# EAGLE design TRHPSVG_Controls_v2 (EAGLE 9.6.2)
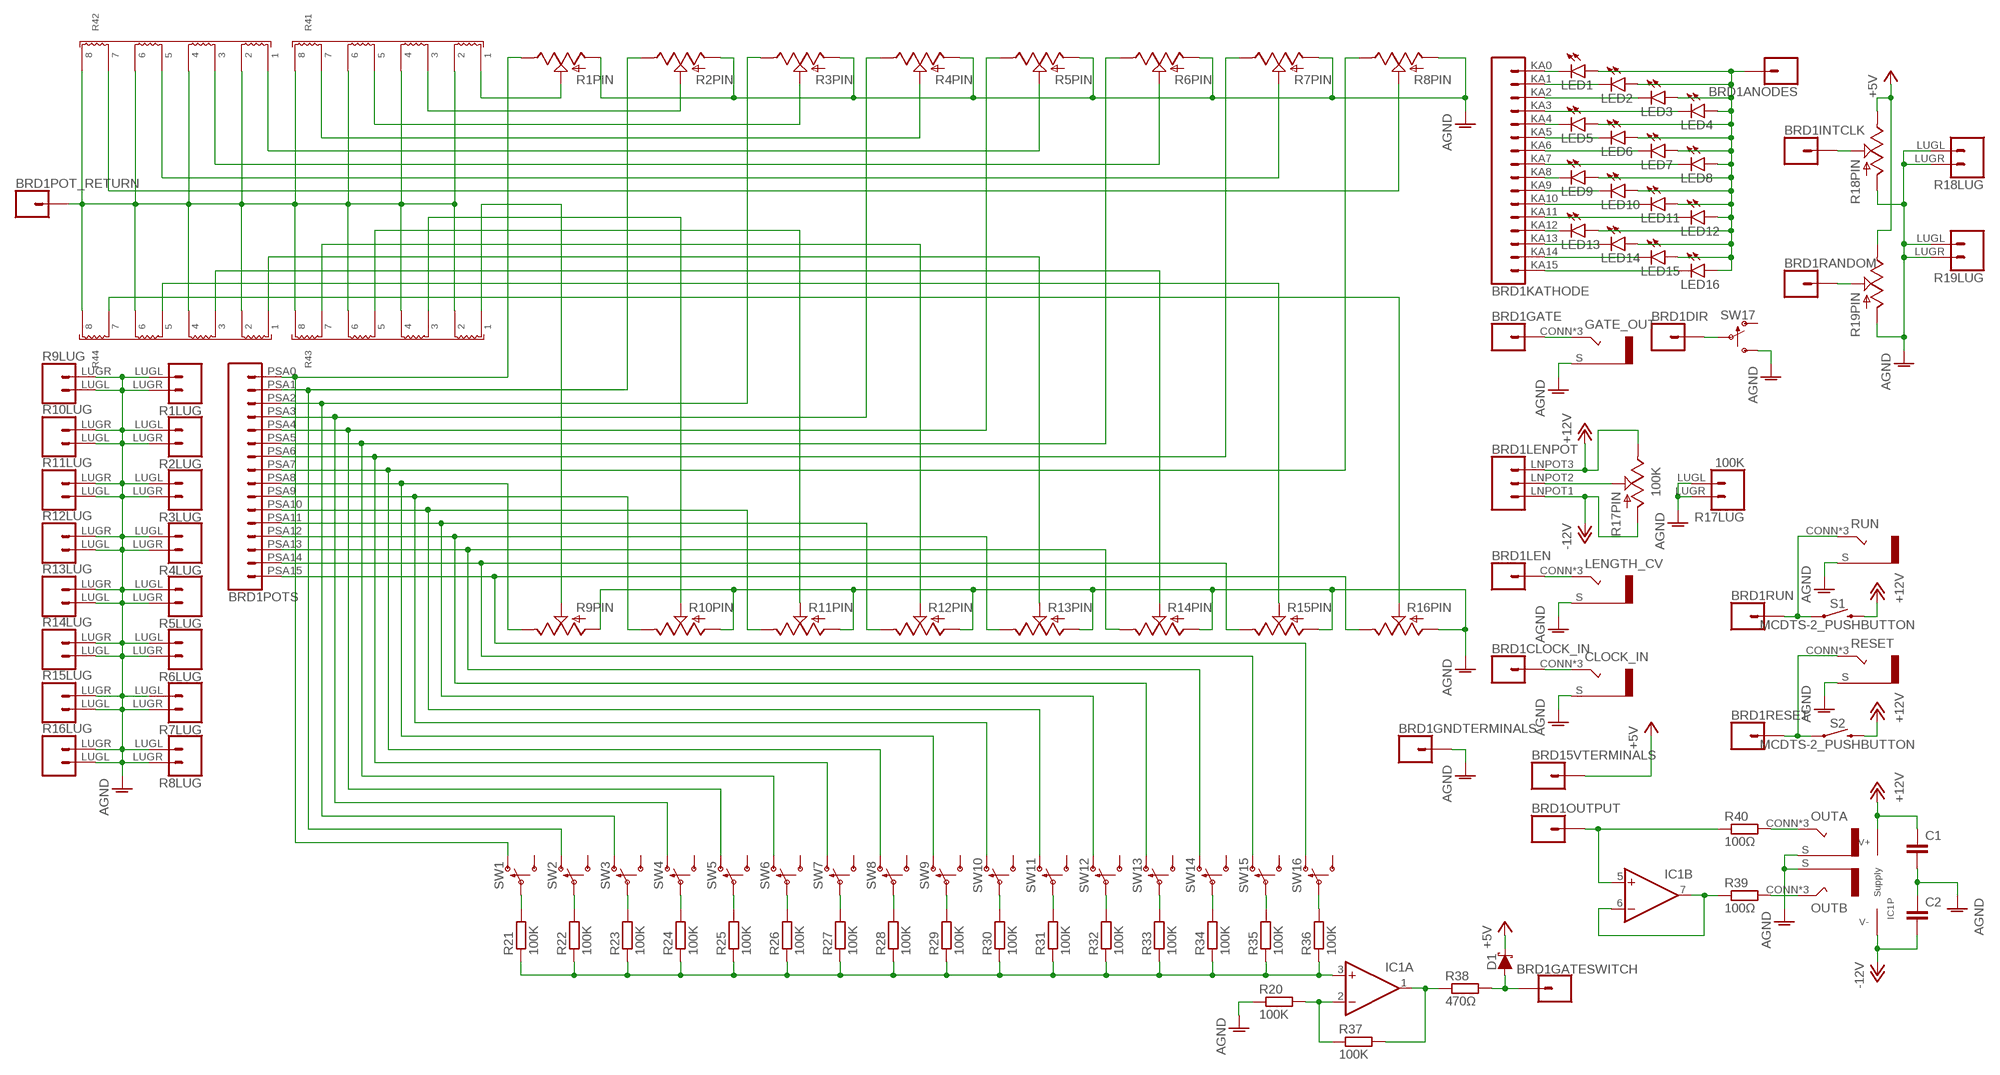
[diagram p0: schematic, sheet 1]

## Parts
BRD1  TRHPSVG_LINK  [TRHPSVG]
C1  C-EU050-025X075  [C050-025X075]
C2  C-EU050-025X075  [C050-025X075]
CLOCK_IN  COMBI-JACK  [COMBOJACK_PANEL]
D1  SCHOTTKY_DO35  [DO35-7]
GATE_OUT  COMBI-JACK  [COMBOJACK_PANEL]
IC1  TL0X2DIL  [DIL08]
LED1  LED3MM  [LED3MM]
LED2  LED3MM  [LED3MM]
LED3  LED3MM  [LED3MM]
LED4  LED3MM  [LED3MM]
LED5  LED3MM  [LED3MM]
LED6  LED3MM  [LED3MM]
LED7  LED3MM  [LED3MM]
LED8  LED3MM  [LED3MM]
LED9  LED3MM  [LED3MM]
LED10  LED3MM  [LED3MM]
LED11  LED3MM  [LED3MM]
LED12  LED3MM  [LED3MM]
LED13  LED3MM  [LED3MM]
LED14  LED3MM  [LED3MM]
LED15  LED3MM  [LED3MM]
LED16  LED3MM  [LED3MM]
LENGTH_CV  COMBI-JACK  [COMBOJACK_PANEL]
OUTA  COMBI-JACK  [COMBOJACK_PANEL]
OUTB  COMBI-JACK  [COMBOJACK_PANEL]
R1  POTENTIOMETER  [ALPHA_RV09_9MMPOT]
R2  POTENTIOMETER  [ALPHA_RV09_9MMPOT]
R3  POTENTIOMETER  [ALPHA_RV09_9MMPOT]
R4  POTENTIOMETER  [ALPHA_RV09_9MMPOT]
R5  POTENTIOMETER  [ALPHA_RV09_9MMPOT]
R6  POTENTIOMETER  [ALPHA_RV09_9MMPOT]
R7  POTENTIOMETER  [ALPHA_RV09_9MMPOT]
R8  POTENTIOMETER  [ALPHA_RV09_9MMPOT]
R9  POTENTIOMETER  [ALPHA_RV09_9MMPOT]
R10  POTENTIOMETER  [ALPHA_RV09_9MMPOT]
R11  POTENTIOMETER  [ALPHA_RV09_9MMPOT]
R12  POTENTIOMETER  [ALPHA_RV09_9MMPOT]
R13  POTENTIOMETER  [ALPHA_RV09_9MMPOT]
R14  POTENTIOMETER  [ALPHA_RV09_9MMPOT]
R15  POTENTIOMETER  [ALPHA_RV09_9MMPOT]
R16  POTENTIOMETER  [ALPHA_RV09_9MMPOT]
R17  100K  POTENTIOMETER  [ALPHA_RV09_9MMPOT]
R18  POTENTIOMETER  [ALPHA_RV09_9MMPOT]
R19  POTENTIOMETER  [ALPHA_RV09_9MMPOT]
R20  100K  R-EU_0207/10  [0207/10]
R21  100K  R-EU_0207/10  [0207/10]
R22  100K  R-EU_0207/10  [0207/10]
R23  100K  R-EU_0207/10  [0207/10]
R24  100K  R-EU_0207/10  [0207/10]
R25  100K  R-EU_0207/10  [0207/10]
R26  100K  R-EU_0207/10  [0207/10]
R27  100K  R-EU_0207/10  [0207/10]
R28  100K  R-EU_0207/10  [0207/10]
R29  100K  R-EU_0207/10  [0207/10]
R30  100K  R-EU_0207/10  [0207/10]
R31  100K  R-EU_0207/10  [0207/10]
R32  100K  R-EU_0207/10  [0207/10]
R33  100K  R-EU_0207/10  [0207/10]
R34  100K  R-EU_0207/10  [0207/10]
R35  100K  R-EU_0207/10  [0207/10]
R36  100K  R-EU_0207/10  [0207/10]
R37  100K  R-EU_0207/10  [0207/10]
R38  470Ω  R-EU_0207/10  [0207/10]
R39  100Ω  R-EU_0207/10  [0207/10]
R40  100Ω  R-EU_0207/10  [0207/10]
R41  4XISO_RESISTOR_NETWORK_2.54  [4_ISO_RES_NET_2.54]
R42  4XISO_RESISTOR_NETWORK_2.54  [4_ISO_RES_NET_2.54]
R43  4XISO_RESISTOR_NETWORK_2.54  [4_ISO_RES_NET_2.54]
R44  4XISO_RESISTOR_NETWORK_2.54  [4_ISO_RES_NET_2.54]
RESET  COMBI-JACK  [COMBOJACK_PANEL]
RUN  COMBI-JACK  [COMBOJACK_PANEL]
S1  MCDTS-2_PUSHBUTTON  [MCDTS-2_PUSHBUTTON]
S2  MCDTS-2_PUSHBUTTON  [MCDTS-2_PUSHBUTTON]
SW1  SPDT_SWITCHDW1  [MICRODPDT-DW1]
SW2  SPDT_SWITCHDW1  [MICRODPDT-DW1]
SW3  SPDT_SWITCHDW1  [MICRODPDT-DW1]
SW4  SPDT_SWITCHDW1  [MICRODPDT-DW1]
SW5  SPDT_SWITCHDW1  [MICRODPDT-DW1]
SW6  SPDT_SWITCHDW1  [MICRODPDT-DW1]
SW7  SPDT_SWITCHDW1  [MICRODPDT-DW1]
SW8  SPDT_SWITCHDW1  [MICRODPDT-DW1]
SW9  SPDT_SWITCHDW1  [MICRODPDT-DW1]
SW10  SPDT_SWITCHDW1  [MICRODPDT-DW1]
SW11  SPDT_SWITCHDW1  [MICRODPDT-DW1]
SW12  SPDT_SWITCHDW1  [MICRODPDT-DW1]
SW13  SPDT_SWITCHDW1  [MICRODPDT-DW1]
SW14  SPDT_SWITCHDW1  [MICRODPDT-DW1]
SW15  SPDT_SWITCHDW1  [MICRODPDT-DW1]
SW16  SPDT_SWITCHDW1  [MICRODPDT-DW1]
SW17  SPDT_SWITCHDW1  [MICRODPDT-DW1]

## Nets
+5V: BRD1.5V1 BRD1.5V2 BRD1.5V3 D1.C R18.C3(PIN:B) R19.C3(PIN:B)
+12V: BRD1.LNPOT3 C1.1 IC1.8(P:V+) R17.C3(PIN:B) S1.P$3 S1.P$4 S2.P$3 S2.P$4
-12V: BRD1.LNPOT1 C2.2 IC1.4(P:V-) R17.C1(PIN:A)
AGND: BRD1.GND1 BRD1.GND2 BRD1.GND3 C1.2 C2.1 CLOCK_IN.S GATE_OUT.S LENGTH_CV.S OUTA.S OUTB.S R1.C1(PIN:A) R1.LUGL R1.LUGR R2.C1(PIN:A) R2.LUGL R2.LUGR R3.C1(PIN:A) R3.LUGL R3.LUGR R4.C1(PIN:A) R4.LUGL R4.LUGR R5.C1(PIN:A) R5.LUGL R5.LUGR R6.C1(PIN:A) R6.LUGL R6.LUGR R7.C1(PIN:A) R7.LUGL R7.LUGR R8.C1(PIN:A) R8.LUGL R8.LUGR R9.C1(PIN:A) R9.LUGL R9.LUGR R10.C1(PIN:A) R10.LUGL R10.LUGR R11.C1(PIN:A) R11.LUGL R11.LUGR R12.C1(PIN:A) R12.LUGL R12.LUGR R13.C1(PIN:A) R13.LUGL R13.LUGR R14.C1(PIN:A) R14.LUGL R14.LUGR R15.C1(PIN:A) R15.LUGL R15.LUGR R16.C1(PIN:A) R16.LUGL R16.LUGR R17.LUGL R17.LUGR R18.C1(PIN:A) R18.LUGL R18.LUGR R19.C1(PIN:A) R19.LUGL R19.LUGR R20.1 RESET.S RUN.S SW17.C3(S)
N$1: R1.C2(PIN:W) R41.P$1
N$2: R4.C2(PIN:W) R41.P$7
N$3: R2.C2(PIN:W) R41.P$3
N$4: BRD1.PSA0 R1.C3(PIN:B) SW1.C1(O)
N$5: BRD1.PSA1 R2.C3(PIN:B) SW2.C1(O)
N$6: R3.C2(PIN:W) R41.P$5
N$7: R5.C2(PIN:W) R42.P$1
N$8: R6.C2(PIN:W) R42.P$3
N$9: R7.C2(PIN:W) R42.P$5
N$10: R8.C2(PIN:W) R42.P$7
N$11: BRD1.PSA2 R3.C3(PIN:B) SW3.C1(O)
N$12: BRD1.PSA3 R4.C3(PIN:B) SW4.C1(O)
N$13: BRD1.PSA4 R5.C3(PIN:B) SW5.C1(O)
N$14: R36.2 SW16.C2(P)
N$15: BRD1.PSA6 R7.C3(PIN:B) SW7.C1(O)
N$16: BRD1.PSA7 R8.C3(PIN:B) SW8.C1(O)
N$17: R9.C2(PIN:W) R43.P$1
N$18: R21.2 SW1.C2(P)
N$19: R22.2 SW2.C2(P)
N$20: R10.C2(PIN:W) R43.P$3
N$21: R23.2 SW3.C2(P)
N$22: R11.C2(PIN:W) R43.P$5
N$23: R12.C2(PIN:W) R43.P$7
N$24: R24.2 SW4.C2(P)
N$25: R25.2 SW5.C2(P)
N$26: R13.C2(PIN:W) R44.P$1
N$27: R14.C2(PIN:W) R44.P$3
N$28: BRD1.PSA13 R14.C3(PIN:B) SW14.C1(O)
N$29: BRD1.PSA14 R15.C3(PIN:B) SW15.C1(O)
N$30: BRD1.PSA15 R16.C3(PIN:B) SW16.C1(O)
N$31: R15.C2(PIN:W) R44.P$5
N$32: R16.C2(PIN:W) R44.P$7
N$33: BRD1.KA0 LED1.K(C)
N$34: BRD1.AN1 BRD1.AN2 LED1.A LED2.A LED3.A LED4.A LED5.A LED6.A LED7.A LED8.A LED9.A LED10.A LED11.A LED12.A LED13.A LED14.A LED15.A LED16.A
N$35: BRD1.KA1 LED2.K(C)
N$36: BRD1.KA2 LED3.K(C)
N$37: BRD1.KA3 LED4.K(C)
N$38: BRD1.KA4 LED5.K(C)
N$39: BRD1.KA5 LED6.K(C)
N$40: BRD1.KA6 LED7.K(C)
N$41: BRD1.KA7 LED8.K(C)
N$42: BRD1.KA8 LED9.K(C)
N$43: BRD1.KA9 LED10.K(C)
N$44: BRD1.KA10 LED11.K(C)
N$45: BRD1.KA11 LED12.K(C)
N$46: BRD1.KA12 LED13.K(C)
N$47: BRD1.KA13 LED14.K(C)
N$48: BRD1.KA14 LED15.K(C)
N$49: BRD1.KA15 LED16.K(C)
N$50: BRD1.LENGTH LENGTH_CV.CONN(T) LENGTH_CV.T1(T) LENGTH_CV.T2(T)
N$51: BRD1.CLKIN CLOCK_IN.CONN(T) CLOCK_IN.T1(T) CLOCK_IN.T2(T)
N$52: BRD1.SEQ IC1.5(B:+IN) R40.1
N$53: BRD1.GATE GATE_OUT.CONN(T) GATE_OUT.T1(T) GATE_OUT.T2(T)
N$54: BRD1.DIR SW17.C2(P)
N$55: BRD1.LNPOT2 R17.C2(PIN:W)
N$56: BRD1.PSA5 R6.C3(PIN:B) SW6.C1(O)
N$57: BRD1.INTC R18.C2(PIN:W)
N$58: BRD1.RND R19.C2(PIN:W)
N$59: BRD1.RUN RUN.CONN(T) RUN.T1(T) RUN.T2(T) S1.P$1 S1.P$2
N$60: BRD1.SRST RESET.CONN(T) RESET.T1(T) RESET.T2(T) S2.P$1 S2.P$2
N$61: R26.2 SW6.C2(P)
N$62: R27.2 SW7.C2(P)
N$63: R28.2 SW8.C2(P)
N$64: R29.2 SW9.C2(P)
N$65: R30.2 SW10.C2(P)
N$66: R31.2 SW11.C2(P)
N$67: R32.2 SW12.C2(P)
N$68: R33.2 SW13.C2(P)
N$69: BRD1.PSA8 R9.C3(PIN:B) SW9.C1(O)
N$70: BRD1.PSA10 R11.C3(PIN:B) SW11.C1(O)
N$71: BRD1.PSA9 R10.C3(PIN:B) SW10.C1(O)
N$72: BRD1.PSA12 R13.C3(PIN:B) SW13.C1(O)
N$73: BRD1.PSA11 R12.C3(PIN:B) SW12.C1(O)
N$74: R34.2 SW14.C2(P)
N$75: R35.2 SW15.C2(P)
N$76: IC1.3(A:+IN) R21.1 R22.1 R23.1 R24.1 R25.1 R26.1 R27.1 R28.1 R29.1 R30.1 R31.1 R32.1 R33.1 R34.1 R35.1 R36.1
N$77: IC1.2(A:-IN) R20.2 R37.1
N$78: IC1.1(A:OUT) R37.2 R38.1
N$79: BRD1.GSW D1.A R38.2
N$80: IC1.6(B:-IN) IC1.7(B:OUT) R39.1
N$81: OUTB.CONN(T) OUTB.T1(T) OUTB.T2(T) R39.2
N$82: OUTA.CONN(T) OUTA.T1(T) OUTA.T2(T) R40.2
N$83: BRD1.POT-R R41.P$2 R41.P$4 R41.P$6 R41.P$8 R42.P$2 R42.P$4 R42.P$6 R42.P$8 R43.P$2 R43.P$4 R43.P$6 R43.P$8 R44.P$2 R44.P$4 R44.P$6 R44.P$8
Unconnected: SW1.C3(S) SW2.C3(S) SW3.C3(S) SW4.C3(S) SW5.C3(S) SW6.C3(S) SW7.C3(S) SW8.C3(S) SW9.C3(S) SW10.C3(S) SW11.C3(S) SW12.C3(S) SW13.C3(S) SW14.C3(S) SW15.C3(S) SW16.C3(S) SW17.C1(O)

## Library data of the parts
BRD1 = ElectricNoodleBox:TRHPSVG_LINK
C1 C2 = rcl:C-EU: CAPACITOR, European symbol; SPICEPREFIX: C
CLOCK_IN GATE_OUT LENGTH_CV OUTA OUTB RESET RUN = ElectricNoodleBox:COMBI-JACK
D1 = ElectricNoodleBox:SCHOTTKY_DO35
IC1 = ElectricNoodleBox:TL0X2
LED1-LED16 = led:LED: LED OSRAM: - CHIPLED LG R971, LG N971, LY N971, LG Q971, LY Q971, LO R971, LY R971 LH N974, LH R974 LS Q976, LO Q976, LY Q976 LO Q996 - Hyper CHIPLED LW Q18S LB Q993, LB Q99A, LB R99A - SideLED LS A670, LO A670, LY A670, LG A670, LP A670 LB A673, LV A673, LT A673, LW A673 LH A674 LY A675 LS A676, LA A676, LO A676, LY A676, LW A676 LS A679, LY A679, LG A679 - Hyper Micro SIDELED® LS Y876, LA Y876, LO Y876, LY Y876 LT Y87S - SmartLED LW L88C, LW L88S LB L89C, LB L89S, LG L890 LS L89K, LO L89K, LY L89K LS L896, LA L896, LO L896, LY L896 - TOPLED LS T670, LO T670, LY T670, LG T670, LP T670 LSG T670, LSP T670, LSY T670, LOP T670, LYG T670 LG T671, LOG T671, LSG T671 LB T673, LV T673, LT T673, LW T673 LH T674 LS T676, LA T676, LO T676, LY T676, LB T676, LH T676, LSB T676, LW T676 LB T67C, LV T67C, LT T67C, LS T67K, LO T67K, LY T67K, LW E67C LS E67B, LA E67B, LO E67B, LY E67B, LB E67C, LV E67C, LT E67C LW T67C LS T679, LY T679, LG T679 LS T770, LO T770, LY T770, LG T770, LP T770 LB T773, LV T773, LT T773, LW T773 LH T774 LS E675, LA E675, LY E675, LS T675 LS T776, LA T776, LO T776, LY T776, LB T776 LHGB T686 LT T68C, LB T68C - Hyper Mini TOPLED® LB M676 - Mini TOPLED Santana® LG M470 LS M47K, LO M47K, LY M47K Source: http://www.osram.convergy.de LUXEON: - LUMILED® LXK2-PW12-R00, LXK2-PW12-S00, LXK2-PW14-U00, LXK2-PW14-V00 LXK2-PM12-R00, LXK2-PM12-S00, LXK2-PM14-U00 LXK2-PE12-Q00, LXK2-PE12-R00, LXK2-PE12-S00, LXK2-PE14-T00, LXK2-PE14-U00 LXK2-PB12-K00, LXK2-PB12-L00, LXK2-PB12-M00, LXK2-PB14-N00, LXK2-PB14-P00, LXK2-PB14-Q00 LXK2-PR12-L00, LXK2-PR12-M00, LXK2-PR14-Q00, LXK2-PR14-R00 LXK2-PD12-Q00, LXK2-PD12-R00, LXK2-PD12-S00 LXK2-PH12-R00, LXK2-PH12-S00 LXK2-PL12-P00, LXK2-PL12-Q00, LXK2-PL12-R00 Source: www.luxeon.com KINGBRIGHT: KA-3528ASYC Source: www.kingbright.com
R1-R19 = ElectricNoodleBox:POTENTIOMETER
R20-R40 = rcl:R-EU_: RESISTOR, European symbol; SPICEPREFIX: R
R41-R44 = ElectricNoodleBox:4XISO_RESISTOR_NETWORK_2.54
S1 S2 = ElectricNoodleBox:MCDTS-2_PUSHBUTTON
SW1-SW17 = ElectricNoodleBox:SPDT_SWITCH

## Board
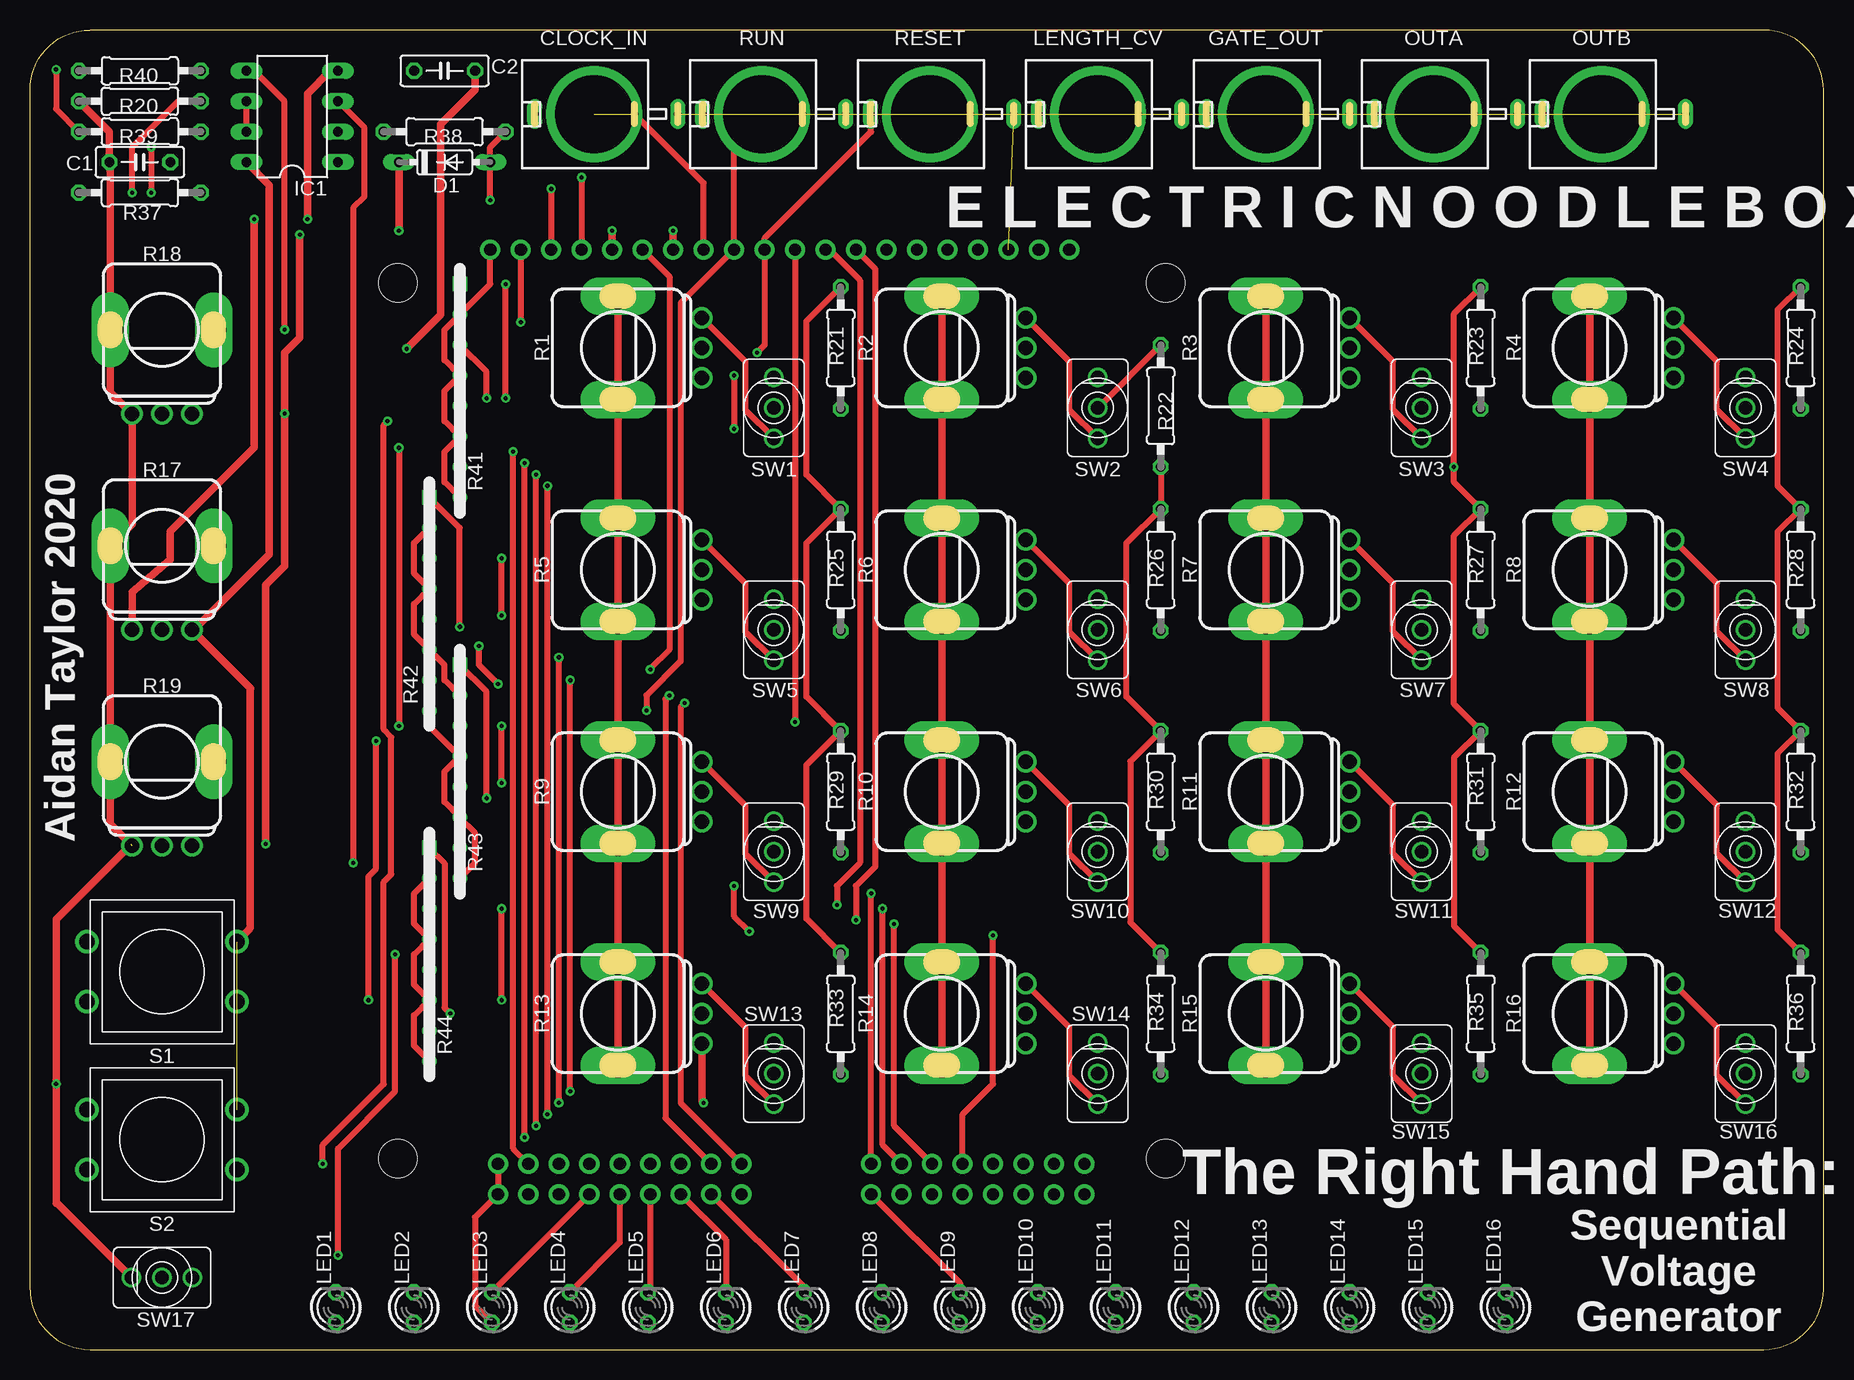
[diagram p1: board, top side]
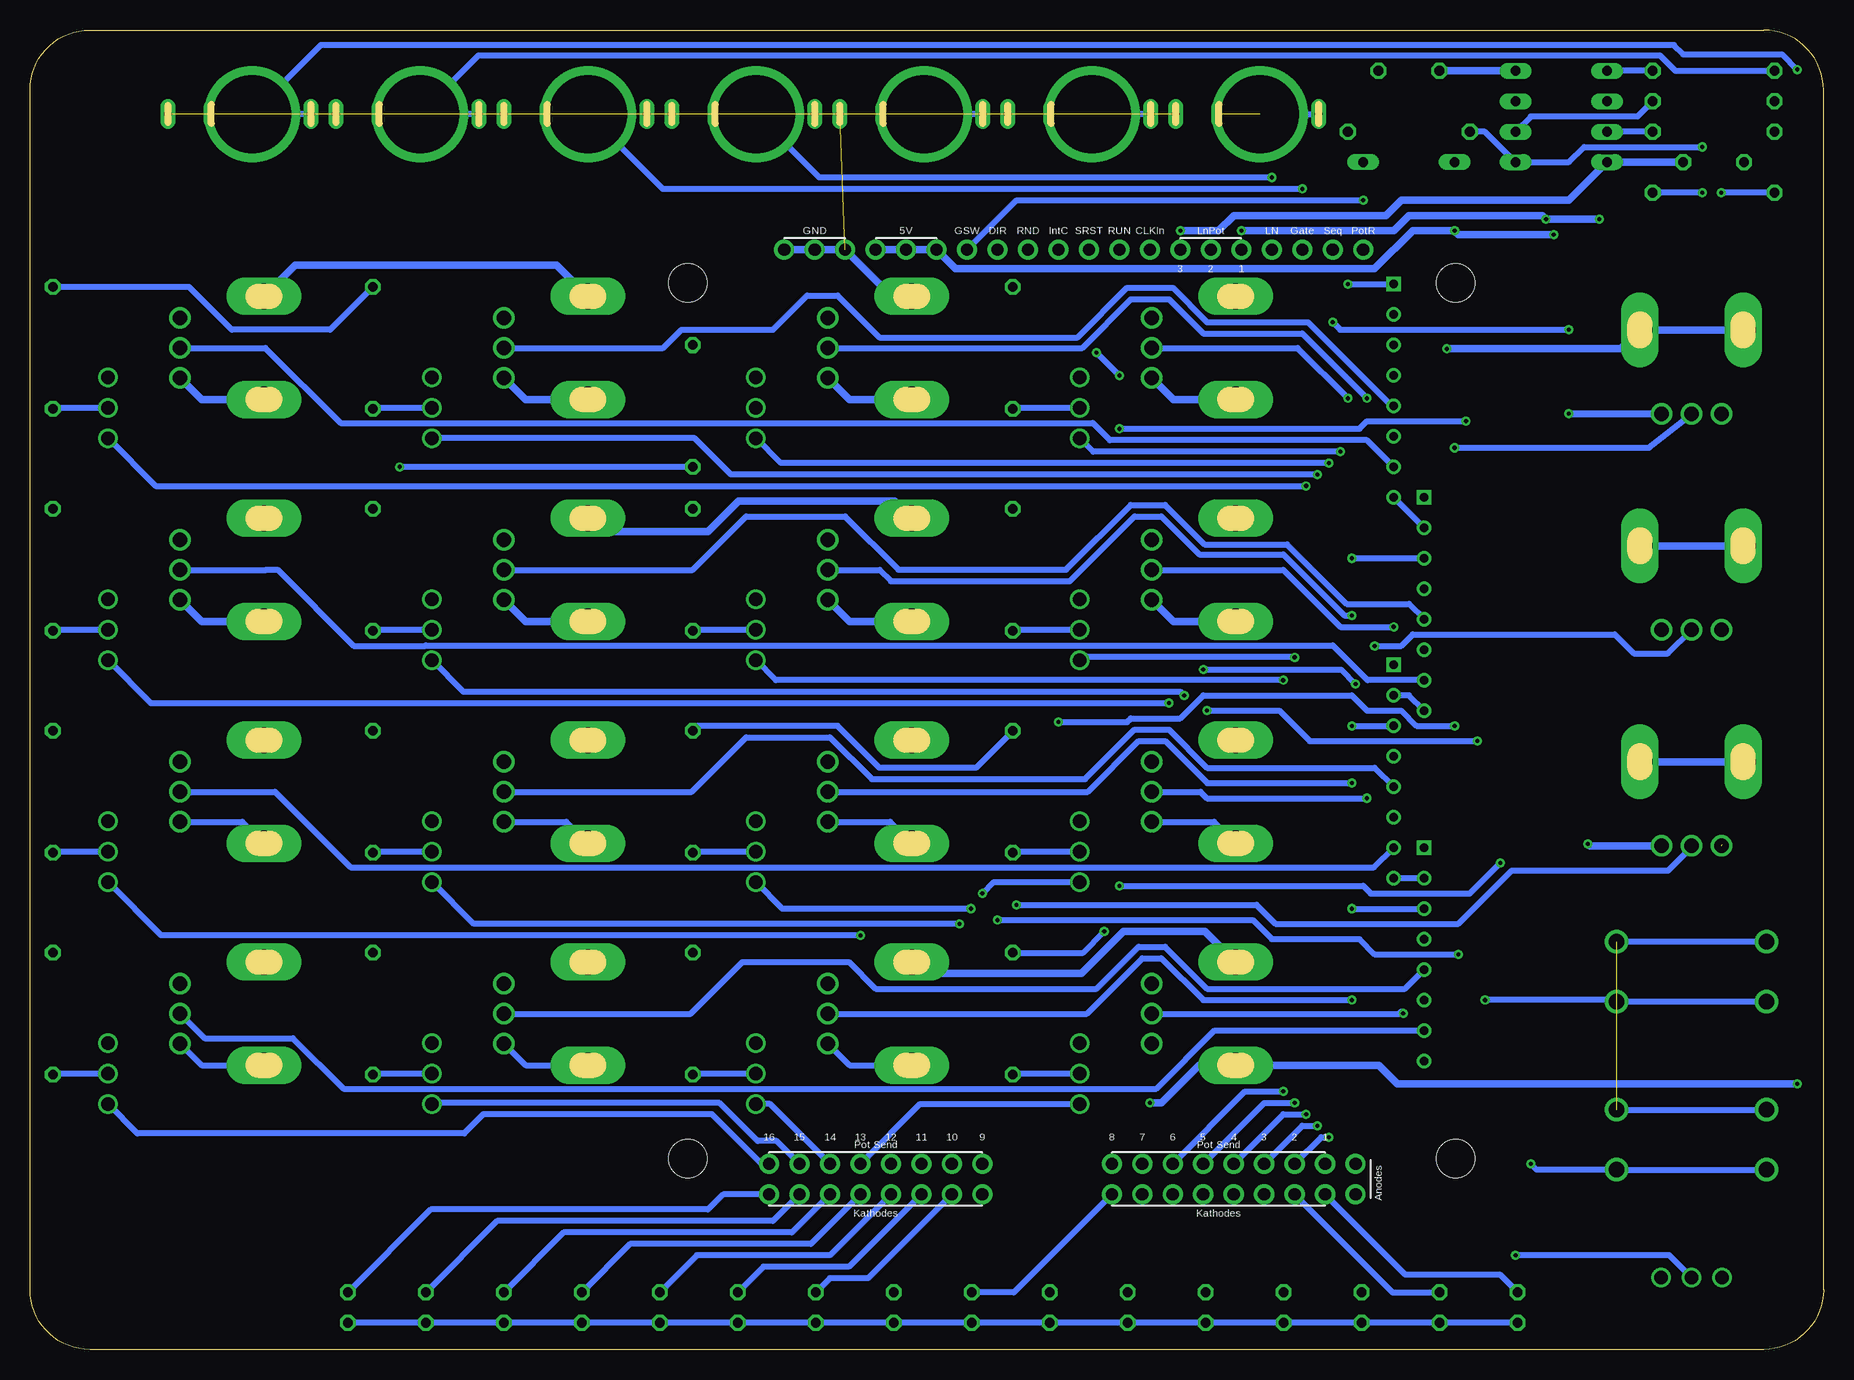
[diagram p2: board, bottom side, seen from below]

Size 149.5 x 110 mm. Coordinates in mm from the lower left corner, seen from the top.
Outline: 0,5 0,105 arc-90 5,110 144.5,110 arc-90 149.5,105 149.5,5 arc-90 144.5,0 5,0 arc-90 0,5
Copper layers (1*16): Top 0.035mm / dielectric 1.5mm / Bottom 0.035mm
Design rules "default": minimum track width 6mil, minimum drill 0.35mm, track to track 6mil, track to pad 6mil, pad to pad 6mil, via to via 6mil, smd to smd 6mil, copper to edge 40mil, drill to drill 6mil, minimum pad ring 10mil, minimum via ring 8mil, stop-mask expansion 4mil, vias tented up to drill 0mil, thermal gap 10mil

### Footprints (pad centres in the part's own frame; a part is rotated, then mirrored left to right if it is on the bottom)
TRHPSVG = drill 1.016 pad 1.676: 5V1 48.26,2.223; 5V2 50.8,2.223; 5V3 53.34,2.223; AN1 13.335,80.963; AN2 13.335,78.422; CLKIN 30.48,2.223; DIR 43.18,2.223; GATE 17.78,2.223; GND1 55.88,2.223; GND2 58.42,2.223; GND3 60.96,2.223; GSW 45.72,2.223; INTC 38.1,2.223; KA0 15.875,80.963; KA1 18.415,80.963; KA2 20.955,80.963; KA3 23.495,80.963; KA4 26.035,80.963; KA5 28.575,80.963; KA6 31.115,80.963; KA7 33.655,80.963; KA8 44.45,80.963; KA9 46.99,80.963; KA10 49.53,80.963; KA11 52.07,80.963; KA12 54.61,80.963; KA13 57.15,80.963; KA14 59.69,80.963; KA15 62.23,80.963; LENGTH 20.32,2.223; LNPOT1 22.86,2.223; LNPOT2 25.4,2.223; LNPOT3 27.94,2.223; POT-R 12.7,2.223; PSA0 15.875,78.422; PSA1 18.415,78.422; PSA2 20.955,78.422; PSA3 23.495,78.422; PSA4 26.035,78.422; PSA5 28.575,78.422; PSA6 31.115,78.422; PSA7 33.655,78.422; PSA8 44.45,78.422; PSA9 46.99,78.422; PSA10 49.53,78.422; PSA11 52.07,78.422; PSA12 54.61,78.422; PSA13 57.15,78.422; PSA14 59.69,78.422; PSA15 62.23,78.422; RND 40.64,2.223; RUN 33.02,2.223; SEQ 15.24,2.223; SRST 35.56,2.223 | hole 3.2: 5,5; 69,5; 5,78; 69,78
C050-025X075 = drill 0.813 octagon: 1 -2.54,0; 2 2.54,0
COMBOJACK_PANEL = drill 6.5 pad 8: CONN 0,0 | drill 0.6 pad 1.27 long: S 0,-7; T1 0,4.92; T2 0,-3.38
DO35-7 = drill 0.813 long: A 3.81,0; C -3.81,0
DIL08 = drill 0.813 long: 1 -3.81,-3.81; 2 -1.27,-3.81; 3 1.27,-3.81; 4 3.81,-3.81; 5 3.81,3.81; 6 1.27,3.81; 7 -1.27,3.81; 8 -3.81,3.81
LED3MM = drill 0.813 octagon: A -1.27,0; K 1.27,0
ALPHA_RV09_9MMPOT = drill 1.2 pad 1.778: C1 -2.5,-7; C2 0,-7; C3 2.5,-7 | drill 2.1 pad 2.8 long: LUGL -4.3,0; LUGR 4.3,0
0207/10 = drill 0.813 octagon: 1 -5.08,0; 2 5.08,0
4_ISO_RES_NET_2.54 = drill 0.7 square: P$1 -8.89,0 | drill 0.7: P$2 -6.35,0; P$3 -3.81,0; P$4 -1.27,0; P$5 1.27,0; P$6 3.81,0; P$7 6.35,0; P$8 8.89,0
MCDTS-2_PUSHBUTTON = drill 1.3: P$1 -6.25,-2.5; P$2 6.25,-2.5; P$3 -6.25,2.5; P$4 6.25,2.5
MICRODPDT-DW1 = drill 1.1: C1 0,-2.54; C2 0,0; C3 0,2.54

### Placement (x,y rotation side)
BRD1  25.67,93.9 180 bottom
C1  9.16,98.98 180 top
C2  34.56,106.6 180 top
CLOCK_IN  47,103 90 top
D1  34.56,98.98 0 top
GATE_OUT  103,103 90 top
IC1  21.86,102.79 90 top
LED1  25.5,3.5 90 top
LED2  32,3.5 90 top
LED3  38.5,3.5 90 top
LED4  45,3.5 90 top
LED5  51.5,3.5 90 top
LED6  58,3.5 90 top
LED7  64.5,3.5 90 top
LED8  71,3.5 90 top
LED9  77.5,3.5 90 top
LED10  84,3.5 90 top
LED11  90.5,3.5 90 top
LED12  97,3.5 90 top
LED13  103.5,3.5 90 top
LED14  110,3.5 90 top
LED15  116.5,3.5 90 top
LED16  123,3.5 90 top
LENGTH_CV  89,103 90 top
OUTA  117,103 90 top
OUTB  131,103 90 top
R1  49,83.5 90 top
R2  76,83.5 90 top
R3  103,83.5 90 top
R4  130,83.5 90 top
R5  49,65 90 top
R6  76,65 90 top
R7  103,65 90 top
R8  130,65 90 top
R9  49,46.5 90 top
R10  76,46.5 90 top
R11  103,46.5 90 top
R12  130,46.5 90 top
R13  49,28 90 top
R14  76,28 90 top
R15  103,28 90 top
R16  130,28 90 top
R17  11,67 0 top
R18  11,85 0 top
R19  11,49 0 top
R20  9.16,104.06 0 top
R21  67.58,83.5 270 top
R22  94.25,78.66 90 top
R23  120.92,83.5 270 top
R24  147.59,83.5 270 top
R25  67.58,65 270 top
R26  94.25,65 270 top
R27  120.92,65 270 top
R28  147.59,65 270 top
R29  67.58,46.5 270 top
R30  94.25,46.5 270 top
R31  120.92,46.5 270 top
R32  147.59,46.5 270 top
R33  67.58,28 270 top
R34  94.25,28 270 top
R35  120.92,28 270 top
R36  147.59,28 270 top
R37  9.16,96.44 0 top
R38  34.56,101.52 0 top
R39  9.16,101.52 180 top
R40  9.16,106.6 180 top
R41  35.83,79.93 270 top
R42  33.29,62.15 270 top
R43  35.83,48.18 270 top
R44  33.29,32.94 270 top
RESET  75,103 90 top
RUN  61,103 90 top
S1  11,31.5 0 top
S2  11,17.5 0 top
SW1  62,78.5 0 top
SW2  89,78.5 0 top
SW3  116,78.5 0 top
SW4  143,78.5 0 top
SW5  62,60 0 top
SW6  89,60 0 top
SW7  116,60 0 top
SW8  143,60 0 top
SW9  62,41.5 0 top
SW10  89,41.5 0 top
SW11  116,41.5 0 top
SW12  143,41.5 0 top
SW13  62,23 0 top
SW14  89,23 0 top
SW15  116,23 0 top
SW16  143,23 0 top
SW17  11,6 90 top

### Tracks (layer width: path | path; a pad name or v marks a point on that pad's centre or on a via)
+5V  (via drill 0.35)
  Top 0.61: v30.75,93.27 D1.C | v19.64,42.15 19.64,63.74 21.23,65.33 v21.23,78.03 21.23,83.11 22.5,84.38 v22.5,92.95
  Bottom 0.61: BRD1.5V3 BRD1.5V2 BRD1.5V1 72.34,90.09 37.42,90.09 34.24,93.27 v30.75,93.27 30.43,92.95 v22.5,92.95 | v21.23,78.03 21.21,78.01 R18.C3 | R19.C3 19.49,42 v19.64,42.15
+12V  (via drill 0.35)  (1 unrouted)
  Top 0.61: BRD1.LNPOT3 v53.61,93.27 | S1.P$4 18.27,35.02 18.27,35.06 18.37,35.16 18.37,55.11 18.38,55.12 R17.C3 13.73,60.05 19.95,66.28 19.95,97.08 IC1.8
  Bottom 0.508: S2.P$4 S2.P$3 | S1.P$3 S1.P$4
  Bottom 0.61: C1.1 IC1.8 21.23,95.81 35.2,95.81 36.47,94.53 49.16,94.53 50.44,93.27 v53.61,93.27
-12V  (via drill 0.35)
  Top 0.61: BRD1.LNPOT1 v48.53,93.27 | v23.13,94.22 23.13,104.69 25.04,106.6 IC1.4 | R17.C1 8.5,63.13 11.7,65.86 11.7,68.18 18.68,75.17 v18.68,94.22
  Bottom 0.61: IC1.4 C2.2 | v18.68,94.22 v23.13,94.22 23.45,94.53 34.56,94.53 35.83,93.27 v48.53,93.27
AGND  (via drill 0.35)  (9 unrouted)
  Top 0.61: R16.LUGL 130,32.75 129.81,32.94 | R16.LUGR R12.LUGL R12.LUGR R8.LUGL R8.LUGR R4.LUGL R4.LUGR | R15.LUGL R15.LUGR R11.LUGL R11.LUGR R7.LUGL R7.LUGR R3.LUGL R3.LUGR | R14.LUGL R14.LUGR R10.LUGL R10.LUGR R6.LUGL R6.LUGR R2.LUGL R2.LUGR | R13.LUGL R13.LUGR R9.LUGL R9.LUGR R5.LUGL R5.LUGR R1.LUGL R1.LUGR | v56.15,20.56 56,20.71 R13.C1 | R20.1 6.62,101.52 C1.2 6.7,98.9 R18.LUGL 6.7,79.8 R18.C1 8.5,68.8 R17.LUGL R19.LUGL 6.7,43.8 R19.C1 | SW17.C3 2.23,12.23 2.17,12.19 v2.17,22.14 2.17,35.85 8.44,42.12 | C2.1 37.1,105.01 34.24,102.16 34.24,86.28 v31.38,83.42
  Bottom 0.508: R16.C1 135.2,23.7 R16.LUGL | R15.C1 108.2,23.7 R15.LUGL | R14.C1 81.2,23.7 R14.LUGL | R12.C1 131.8,44 R12.LUGL | R11.C1 104.8,44 R11.LUGL | R10.C1 77.8,44 R10.LUGL | R9.C1 50.8,44 R9.LUGL
  Bottom 0.61: v56.15,20.56 55.2,20.56 52.05,23.7 R13.LUGL 37.07,23.7 35.51,22.14 v2.17,22.14 | R8.C1 135.2,60.7 R8.LUGL | R7.C1 108.2,60.7 R7.LUGL | R6.C1 81.2,60.7 R6.LUGL | R5.C1 54.2,60.7 R5.LUGL | R1.C1 54.2,79.2 R1.LUGL | R2.C1 81.2,79.2 R2.LUGL | R3.C1 108.2,79.2 R3.LUGL | R4.C1 135.2,79.2 R4.LUGL | R2.LUGR 77.67,87.8 BRD1.GND1 BRD1.GND2 BRD1.GND3 | R6.LUGR 77.42,70.72 90.44,70.72 92.98,68.18 101.88,68.18 R7.LUGR | R13.LUGR 51.55,34.84 58.37,34.84 61.87,31.35 75.05,31.35 R14.LUGR | R3.LUGR 105.61,90.41 127.39,90.41 R4.LUGR | R18.LUGL R18.LUGR 16.71,83.59 16.95,83.42 v31.38,83.42 | R17.LUGL R17.LUGR | R19.LUGL R19.LUGR
N$1  (via drill 0.35)
  Top 0.508: v39.64,79.3 v39.64,88.82
  Bottom 0.508: R1.C2 43.84,83.5 v39.64,79.3 | v39.64,88.82 R41.P$1
N$2
  Bottom 0.508: R4.C2 129.89,83.5 123.62,77.24 60.91,77.24 59.48,75.8 38.05,75.8 R41.P$7
N$3  (via drill 0.35)
  Top 0.508: v38.05,79.3 38.05,81.52 R41.P$3
  Bottom 0.508: R2.C2 61.79,83.5 57.74,87.55 54.56,87.55 51.7,84.69 43.45,84.69 v38.05,79.3
N$4  (via drill 0.35)
  Top 0.508: BRD1.PSA0 40.27,16.75 v40.27,74.85 | SW1.C1 59.64,78.32 59.64,82.36 R1.C3
  Bottom 0.508: SW1.C1 60.89,74.85 v40.27,74.85
N$5  (via drill 0.35)
  Top 0.508: v41.23,17.7 v41.23,73.9 | SW2.C1 86.63,78.33 86.63,82.37 R2.C3
  Bottom 0.508: BRD1.PSA1 41.86,17.7 v41.23,17.7 | v41.23,73.9 86.94,73.9 SW2.C1
N$6
  Bottom 0.508: R3.C2 96.71,83.5 95.2,85.01 87.58,85.01 84.72,87.87 82.19,87.87 78.69,84.38 62.18,84.38 58.05,88.5 54.24,88.5 51.39,85.64 42.97,85.64 35.99,78.66 R41.P$5
N$7  (via drill 0.35)
  Top 0.508: v35.83,60.24 35.83,68.5 R42.P$1
  Bottom 0.508: R5.C2 45.03,65 40.27,60.24 v35.83,60.24
N$8  (via drill 0.35)
  Top 0.508: v39.32,61.2 v39.32,65.96
  Bottom 0.508: R6.C2 78.69,65 77.74,64.06 62.82,64.06 57.42,69.45 55.2,69.45 52.02,66.28 45.04,66.28 39.96,61.2 v39.32,61.2 | v39.32,65.96 R42.P$3
N$9
  Bottom 0.508: R7.C2 94.26,65 89.81,69.45 81.55,69.45 77.11,65.01 63.14,65.01 57.74,70.41 54.88,70.41 51.58,67.11 44.72,67.11 39.76,62.15 34.56,62.15 R42.P$5
N$10
  Bottom 0.508: R8.C2 129.82,65 129.81,65.01 128.86,65.01 122.51,58.66 116.54,58.66 116.51,58.69 40.91,58.69 38.02,55.8 R42.P$7
N$11  (via drill 0.35)
  Top 0.508: v42.18,18.65 v42.18,72.94 | SW3.C1 113.62,78.34 113.62,82.38 R3.C3
  Bottom 0.508: BRD1.PSA2 43.45,18.65 v42.18,18.65 | v42.18,72.94 91.08,72.94 94.09,75.96 SW3.C1
N$12  (via drill 0.35)
  Top 0.508: v43.13,19.61 v43.13,71.99 | SW4.C1 140.62,78.34 140.6,78.34 140.6,82.39 R4.C3
  Bottom 0.508: BRD1.PSA3 45.04,19.61 v43.13,19.61 | SW4.C1 139.03,71.99 v43.13,71.99
N$13  (via drill 0.35)
  Top 0.508: v44.09,20.56 v44.09,57.7 | SW5.C1 59.64,59.82 59.64,63.86 R5.C3
  Bottom 0.508: BRD1.PSA4 46.62,20.56 v44.09,20.56 | v44.09,57.7 44.09,57.78 61.68,57.78 SW5.C1
N$14
  Bottom 0.508: SW16.C2 147.51,23 R36.2
N$15  (via drill 0.35)
  Top 0.508: BRD1.PSA6 52.98,19.29 52.98,54.21 v53.29,54.53 | SW7.C1 113.62,59.84 113.62,63.88 R7.C3
  Bottom 0.508: v53.29,54.53 53.61,54.85 113.39,54.85 SW7.C1
N$16  (via drill 0.35)
  Top 0.508: BRD1.PSA7 54.24,20.56 54.24,53.58 v54.56,53.9 | SW8.C1 140.6,59.85 140.6,63.9 R8.C3
  Bottom 0.508: v54.56,53.9 139.44,53.9 SW8.C1
N$17  (via drill 0.35)
  Top 0.508: v38.05,45.96 38.05,54.85 R43.P$1
  Bottom 0.508: R9.C2 51.93,46.5 51.39,45.96 v38.05,45.96
N$18
  Bottom 0.508: SW1.C2 67.5,78.5 R21.2
N$19
  Top 0.508: SW2.C2 R22.2
N$20  (via drill 0.35)
  Top 0.508: v39.32,47.23 v39.32,51.99
  Bottom 0.508: R10.C2 61.32,46.5 57.1,50.72 54.86,50.72 51.37,47.23 v39.32,47.23 | v39.32,51.99 R43.P$3
N$21
  Bottom 0.508: SW3.C2 120.84,78.5 R23.2
N$22
  Bottom 0.508: R11.C2 94.34,46.5 89.81,51.04 82.82,51.04 79.33,47.55 61.55,47.55 57.42,51.67 54.56,51.67 51.39,48.5 37.42,48.5 R43.P$5
N$23
  Bottom 0.508: R12.C2 129.08,46.5 122.77,40.19 37.47,40.19 R43.P$7
N$24
  Bottom 0.508: SW4.C2 147.51,78.5 R24.2
N$25
  Bottom 0.508: SW5.C2 67.5,60 R25.2
N$26  (via drill 0.35)
  Top 0.508: v35.04,28.02 34.56,28.5 34.56,40.56 R44.P$1
  Bottom 0.508: R13.C2 35.37,28 35.2,28.18 v35.04,28.02
N$27  (via drill 0.35)
  Top 0.508: v39.32,29.13 v39.32,36.75
  Bottom 0.508: R14.C2 61.41,28 56.78,32.62 55.2,32.62 51.7,29.13 v39.32,29.13 | v39.32,36.75 R44.P$3
N$28
  Top 0.508: SW14.C1 86.63,22.83 86.63,26.87 R14.C3
  Bottom 0.508: BRD1.PSA13 87.8,20.46 SW14.C1
N$29
  Top 0.508: SW15.C1 113.62,22.84 113.62,26.88 R15.C3
  Bottom 0.508: BRD1.PSA14 87.27,17.38 88.85,17.38 92.03,20.56 115.9,20.56 SW15.C1
N$30
  Top 0.508: SW16.C1 140.6,22.86 140.6,26.91 137.01,30.5 R16.C3
  Bottom 0.508: BRD1.PSA15 88.53,15.48 92.66,19.61 111.71,19.61 113.3,18.02 140.56,18.02 SW16.C1
N$31
  Bottom 0.508: R15.C2 94.43,28 90.12,32.3 81.23,32.3 79.01,30.08 60.59,30.08 57.1,33.58 54.88,33.58 51.39,30.08 34.88,30.08 R44.P$5
N$32
  Bottom 0.508: R16.C2 134.96,25.95 127.59,25.95 123.37,21.74 55.61,21.74 50.75,26.59 R44.P$7
N$33
  Bottom 0.508: BRD1.KA0 34.88,6.27 27,6.27 LED1.K
N$34
  Top 0.508: BRD1.AN2 BRD1.AN1 37.1,11.03 37.1,3.63 LED3.A
  Bottom 0.508: LED1.A LED2.A LED3.A LED4.A LED5.A LED6.A LED7.A LED8.A LED9.A LED10.A LED11.A LED12.A LED13.A LED14.A LED15.A LED16.A
N$35
  Bottom 0.508: BRD1.KA1 35.92,4.77 LED2.K
N$36
  Top 0.508: BRD1.KA2 38.5,4.81 LED3.K
N$37
  Top 0.508: BRD1.KA3 49.16,8.94 LED4.K
N$38
  Top 0.508: BRD1.KA4 51.7,4.97 LED5.K
N$39
  Top 0.508: BRD1.KA5 58,9.18 LED6.K
N$40
  Top 0.508: BRD1.KA6 64.5,5.22 LED7.K
N$41
  Bottom 0.508: BRD1.KA7 67.49,4.77 LED8.K
N$42
  Top 0.508: BRD1.KA8 77.5,5.56 LED9.K
N$43
  Bottom 0.508: BRD1.KA9 79.64,5.95 82.82,5.95 LED10.K
N$44
  Bottom 0.508: BRD1.KA10 81.23,6.91 88.36,6.91 LED11.K
N$45
  Bottom 0.508: BRD1.KA11 82.82,7.86 93.91,7.86 LED12.K
N$46
  Bottom 0.508: BRD1.KA12 84.41,8.81 99.46,8.81 LED13.K
N$47
  Bottom 0.508: BRD1.KA13 86,9.76 105.01,9.76 LED14.K
N$48
  Bottom 0.508: BRD1.KA14 87.58,10.71 110.56,10.71 LED15.K
N$49
  Bottom 0.508: BRD1.KA15 91.71,12.94 92.98,11.67 116.1,11.67 LED16.K
N$50  (via drill 0.35)  (2 unrouted)
  Top 0.508: v45.99,97.71 BRD1.LENGTH
  Bottom 0.508: v45.99,97.71 83.71,97.71 LENGTH_CV.CONN
N$51  (1 unrouted)
  Top 0.508: CLOCK_IN.T2 56.15,97.23 BRD1.CLKIN
  Bottom 0.508: CLOCK_IN.CONN CLOCK_IN.T1
N$52  (via drill 0.35)
  Top 0.508: BRD1.SEQ v40.91,85.64 | v21.23,85.01 21.23,104.06 18.68,106.6 IC1.5
  Bottom 0.508: v40.91,85.64 40.27,85.01 v21.23,85.01 | R40.1 IC1.5
N$53  (via drill 0.35)  (2 unrouted)
  Top 0.508: v43.45,96.76 BRD1.GATE
  Bottom 0.508: v43.45,96.76 96.76,96.76 GATE_OUT.CONN
N$54  (via drill 0.35)
  Top 0.508: BRD1.DIR 70.44,90.09 70.44,40.24 68.85,38.66 v68.85,35.8 | v30.43,32.94 30.43,21.51 25.67,16.75 v25.67,7.86
  Bottom 0.508: v68.85,35.8 47.58,35.8 45.99,34.21 38.69,34.21 37.42,32.94 v30.43,32.94 | SW17.C2 12.86,7.86 v25.67,7.86
N$55  (via drill 0.35)
  Top 0.508: BRD1.LNPOT2 53.29,89.45 53.29,58.34 51.7,56.75 v51.7,56.67 | v39.01,55.48 37.42,57.07 v37.42,58.66
  Bottom 0.508: v51.7,56.67 40.2,56.67 v39.01,55.48 | v37.42,58.66 35.2,58.66 34.24,59.61 17.41,59.61 15.83,58.02 12.97,58.02 R17.C2
N$56  (via drill 0.35)
  Top 0.508: v45.04,21.51 v45.04,55.8 | SW6.C1 86.63,59.83 86.63,63.87 R6.C3
  Bottom 0.508: BRD1.PSA5 48.21,21.51 v45.04,21.51 | v45.04,55.8 87.34,55.8 SW6.C1
N$57  (via drill 0.35)
  Top 0.508: BRD1.INTC v63.77,52.31 | v30.75,75.17 v30.75,51.99
  Bottom 0.508: v63.77,52.31 58.05,52.31 57.74,52.62 53.61,52.62 51.7,54.53 39.32,54.53 38.05,53.26 35.2,53.26 33.92,51.99 v30.75,51.99 | v30.75,75.17 14.54,75.17 R18.C2
N$58  (via drill 0.35)
  Top 0.508: v67.26,37.07 67.26,38.66 69.17,40.56 69.17,89.14 66.63,91.68 BRD1.RND
  Bottom 0.508: v67.26,37.07 47.26,37.07 45.67,35.48 30.43,35.48 25.99,39.92 12.96,39.92 11,41.88 R19.C2
N$59  (via drill 0.35)
  Top 0.508: v51.39,53.26 51.39,54.53 54.24,57.39 54.24,87.23 BRD1.RUN 58.69,100.69 RUN.CONN | v28.84,50.72 28.84,40.06 28.21,39.43 v28.21,29.13
  Bottom 0.508: v51.39,53.26 45.35,53.26 42.81,50.72 v28.84,50.72 | S1.P$1 S1.P$2 17.38,29.13 v28.21,29.13 | RUN.T1 RUN.CONN RUN.T2
N$60  (via drill 0.35)
  Top 0.508: v60.59,83.11 61.23,83.74 BRD1.SRST 61.23,92.63 70.12,101.52 70.12,102.96 RESET.T1 | v58.69,81.2 v58.69,76.75 | v24.4,15.48 24.4,17.06 29.48,22.14 29.48,38.97 30.11,39.61 30.11,51.04 29.48,51.67 29.48,77.07 v29.8,77.39
  Bottom 0.508: v29.8,77.39 38.05,77.39 38.69,76.75 v58.69,76.75 | v60.59,83.11 v58.69,81.2 | S2.P$1 S2.P$2 23.92,15 v24.4,15.48 | RESET.T1 RESET.CONN RESET.T2
N$61
  Bottom 0.508: SW6.C2 94.17,60 R26.2
N$62
  Bottom 0.508: SW7.C2 120.84,60 R27.2
N$63
  Bottom 0.508: SW8.C2 147.51,60 R28.2
N$64
  Bottom 0.508: SW9.C2 67.5,41.5 R29.2
N$65
  Bottom 0.508: SW10.C2 94.17,41.5 R30.2
N$66
  Bottom 0.508: SW11.C2 120.84,41.5 R31.2
N$67
  Bottom 0.508: SW12.C2 147.51,41.5 R32.2
N$68
  Bottom 0.508: SW13.C2 67.5,23 R33.2
N$69  (via drill 0.35)
  Top 0.508: BRD1.PSA8 v70.12,38.02 | SW9.C1 59.64,41.32 59.64,45.36 R9.C3
  Bottom 0.508: v70.12,38.02 69.18,38.96 SW9.C1
N$70  (via drill 0.35)
  Top 0.508: BRD1.PSA10 72.03,18.65 v72.03,35.48 | SW11.C1 113.62,41.34 113.62,45.38 R11.C3
  Bottom 0.508: v72.03,35.48 112.52,35.48 SW11.C1
N$71  (via drill 0.35)
  Top 0.508: BRD1.PSA9 71.07,17.06 v71.07,36.75 | SW10.C1 86.63,41.33 86.63,45.37 R10.C3
  Bottom 0.508: v71.07,36.75 86.79,36.75 SW10.C1
N$72
  Top 0.508: SW13.C1 59.64,22.82 59.64,26.86 R13.C3
  Bottom 0.508: BRD1.PSA12 75.3,20.46 SW13.C1
N$73  (via drill 0.35)
  Top 0.508: BRD1.PSA11 77.74,19.61 80.28,22.14 v80.28,34.53 | SW12.C1 140.6,41.35 140.6,45.4 R12.C3
  Bottom 0.508: v80.28,34.53 138.57,34.53 SW12.C1
N$74
  Bottom 0.508: SW14.C2 94.17,23 R34.2
N$75
  Bottom 0.508: SW15.C2 120.84,23 R35.2
N$76  (via drill 0.35)
  Top 0.508: R22.1 R26.1 91.39,67.22 91.39,54.44 R30.1 91.71,49.04 91.71,35.62 R34.1 | R35.1 118.7,35.3 118.7,49.36 R31.1 118.7,53.8 118.7,67.86 R27.1 118.7,72.3 v118.7,73.58 118.7,86.36 R23.1 | R36.1 145.69,34.98 145.69,49.67 R32.1 145.69,53.48 145.69,68.17 R28.1 145.69,71.98 145.69,86.67 R24.1 | R33.1 64.72,35.94 64.72,48.72 R29.1 64.72,54.44 64.72,67.22 R25.1 64.72,72.94 64.72,85.72 R21.1 | v59.96,34.84 58.69,36.11 v58.69,38.66 | v26.94,40.56 26.94,95.17 27.89,96.12 27.89,101.84 IC1.3
  Bottom 0.508: R22.1 v118.7,73.58 | R23.1 124.49,85.01 132.67,85.01 136.24,88.58 R24.1 | R29.1 70.66,48.5 78.69,48.5 82.19,51.99 93.84,51.99 R30.1 | R33.1 61.73,33.08 v59.96,34.84 | v58.69,38.66 38.37,38.66 37.73,38.02 29.48,38.02 v26.94,40.56
N$77  (via drill 0.35)
  Top 0.508: v8.53,96.44 8.53,100.25 12.34,104.06 R20.2
  Bottom 0.508: R20.2 15.51,102.79 24.4,102.79 IC1.2 | R37.1 v8.53,96.44
N$78  (via drill 0.35)
  Top 0.508: v10.11,100.25 v10.11,96.44
  Bottom 0.508: R38.1 28.21,101.52 IC1.1 21.23,98.98 19.95,100.25 v10.11,100.25 | v10.11,96.44 R37.2
N$79  (via drill 0.35)
  Top 0.508: v38.37,95.81 D1.A 38.37,100.25 R38.2
  Bottom 0.508: BRD1.GSW 67.26,95.81 v38.37,95.81
N$80
  Top 0.508: IC1.7 IC1.6
  Bottom 0.508: R39.1 IC1.7
N$81  (via drill 0.35)
  Top 0.508: R39.2 2.17,103.42 v2.17,106.7
  Bottom 0.508: v2.17,106.7 3.45,107.97 11.7,107.97 12.46,108.73 125.27,108.73 OUTB.CONN | OUTB.T1 OUTB.CONN | OUTB.CONN OUTB.T2
N$82
  Bottom 0.508: R40.2 12.34,106.6 13.61,107.87 112.13,107.87 OUTA.CONN | OUTA.T1 OUTA.CONN | OUTA.CONN OUTA.T2
N$83
  Top 0.508: BRD1.POT-R 38.37,88.82 R41.P$2 34.56,85.01 34.56,82.47 R41.P$4 34.56,79.93 34.56,77.39 R41.P$6 34.56,74.85 34.56,72.31 R41.P$8 | R44.P$8 32.02,25.32 32.02,27.86 R44.P$6 32.02,30.4 32.02,32.94 R44.P$4 32.02,35.48 32.02,38.02 R44.P$2 | R43.P$8 37.1,40.56 37.1,43.1 R43.P$6 34.56,45.64 34.56,48.18 R43.P$4 33.29,51.99 R42.P$8 | R43.P$2 34.56,55.8 34.56,57.07 R42.P$6 32.02,59.61 32.02,62.15 R42.P$4 32.02,64.69 32.02,67.23 R42.P$2
  Bottom 0.508: R44.P$2 R43.P$8 | R42.P$8 34.56,54.53 R43.P$2 | R42.P$2 R41.P$8

### Text on the board
tPlace: E L E C T R I C N O O D L E B O X | Aidan Taylor 2020 | The Right Hand Path: | Sequential / Voltage / Generator